# EAGLE schematic GucciMain (EAGLE 9.1.0)
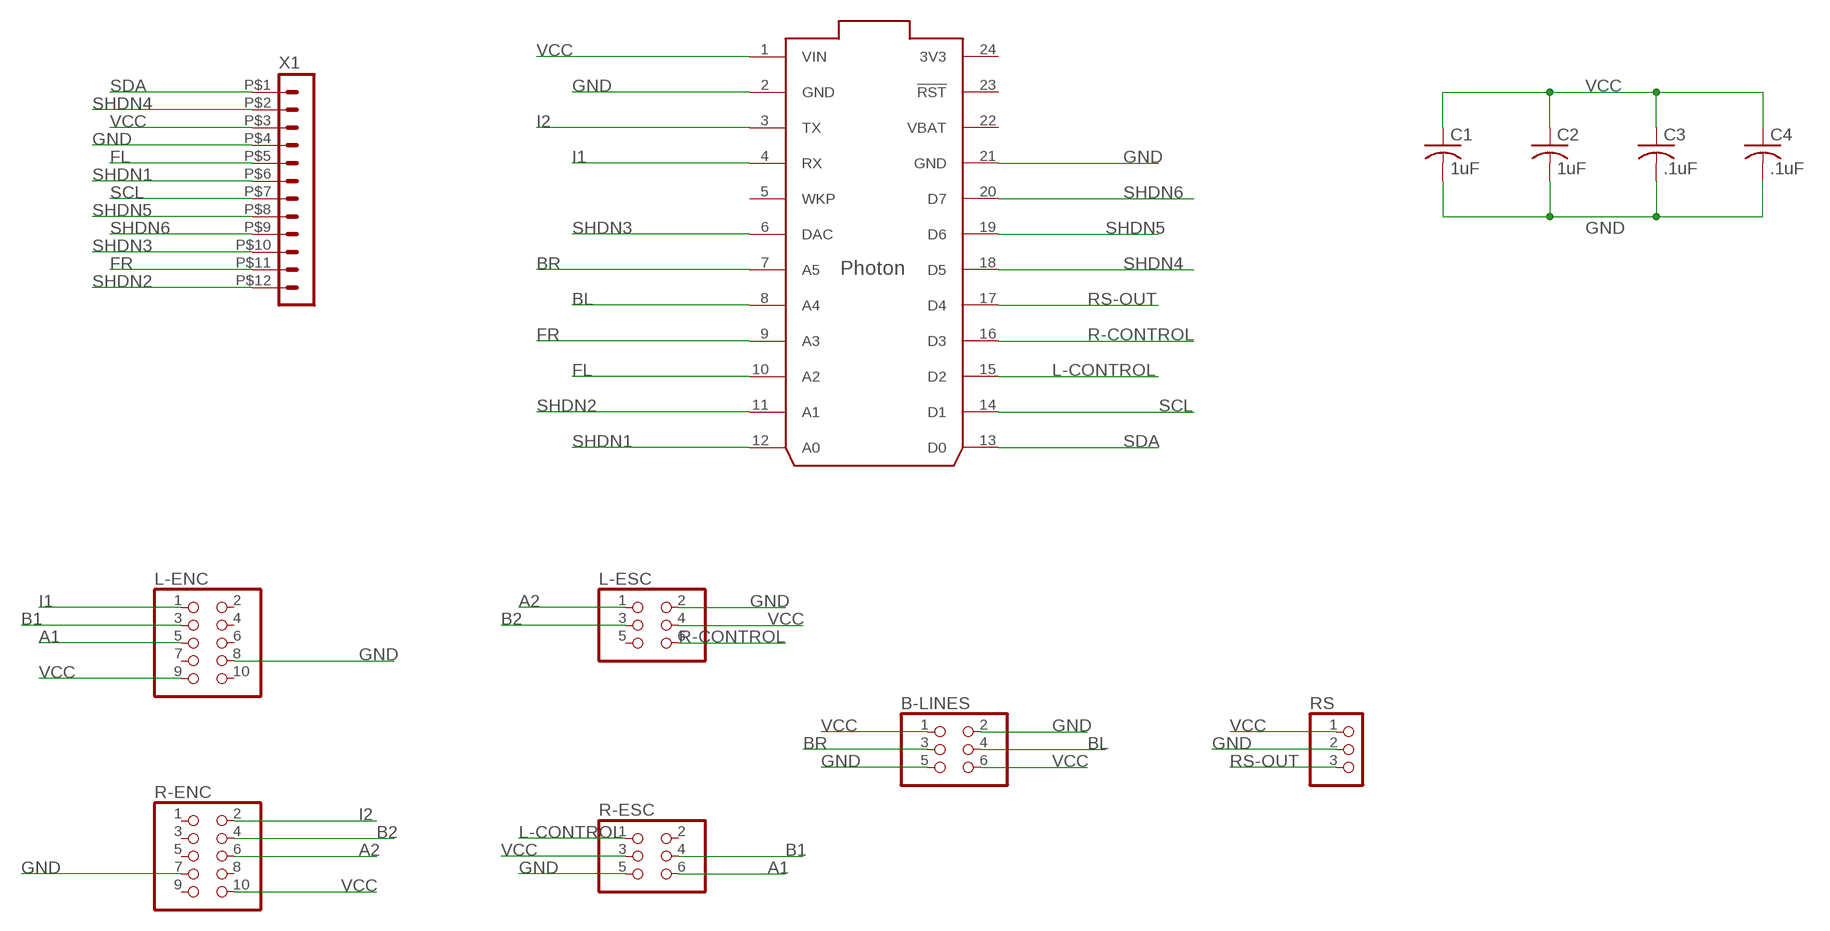
[diagram p0: schematic, sheet 1]

## Parts
B-LINES  PINHD-2X3/90  [2X03/90]
C1  1uF  C-USC0402  [C0402]
C2  1uF  C-USC0402  [C0402]
C3  .1uF  C-USC0402  [C0402]
C4  .1uF  C-USC0402  [C0402]
L-ENC  PINHD-2X5/90  [2X05/90]
L-ESC  PINHD-2X3  [2X03]
PHOTON  PHOTON  PHOTON_WITH_HEADERS  [PHOTON]
R-ENC  PINHD-2X5/90  [2X05/90]
R-ESC  PINHD-2X3  [2X03]
RS  PINHD-1X3  [1X03]
X1  HEADER_POS12_43045-1212  [43045-1212]

## Nets
A1: L-ENC.5 R-ESC.6
A2: L-ESC.1 R-ENC.6
B1: L-ENC.3 R-ESC.4
B2: L-ESC.3 R-ENC.4
BL: B-LINES.4 PHOTON.8(A4)
BR: B-LINES.3 PHOTON.7(A5)
FL: PHOTON.10(A2) X1.P$5
FR: PHOTON.9(A3) X1.P$11
GND: B-LINES.2 B-LINES.5 C1.2 C2.2 C3.2 C4.2 L-ENC.8 L-ESC.2 PHOTON.2(GND) PHOTON.21(GND) R-ENC.7 R-ESC.5 RS.2 X1.P$4
I1: L-ENC.1 PHOTON.4(RX)
I2: PHOTON.3(TX) R-ENC.2
L-CONTROL: PHOTON.15(D2) R-ESC.1
R-CONTROL: L-ESC.6 PHOTON.16(D3)
RS-OUT: PHOTON.17(D4) RS.3
SCL: PHOTON.14(D1) X1.P$7
SDA: PHOTON.13(D0) X1.P$1
SHDN1: PHOTON.12(A0) X1.P$6
SHDN2: PHOTON.11(A1) X1.P$12
SHDN3: PHOTON.6(DAC) X1.P$10
SHDN4: PHOTON.18(D5) X1.P$2
SHDN5: PHOTON.19(D6) X1.P$8
SHDN6: PHOTON.20(D7) X1.P$9
VCC: B-LINES.1 B-LINES.6 C1.1 C2.1 C3.1 C4.1 L-ENC.9 L-ESC.4 PHOTON.1(VIN) R-ENC.10 R-ESC.3 RS.1 X1.P$3
Unconnected: L-ENC.2 L-ENC.4 L-ENC.6 L-ENC.7 L-ENC.10 L-ESC.5 PHOTON.5(WKP) PHOTON.23(!RST) R-ENC.1 R-ENC.3 R-ENC.5 R-ENC.8 R-ENC.9 R-ESC.2

## Power pins joined to a net without a drawn wire
3V3: PHOTON.24(3V3)
VBAT: PHOTON.22(VBAT)

## Library data of the parts
B-LINES L-ESC R-ESC = pinhead:PINHD-2X3: PIN HEADER
C1-C4 = rcl:C-US: CAPACITOR, American symbol; SPICEPREFIX: C
L-ENC R-ENC = pinhead:PINHD-2X5: PIN HEADER
PHOTON = Particle:PHOTON
RS = pinhead:PINHD-1X3: PIN HEADER
X1 = con-molex-micro-fit-3_0:HEADER_POS12_?: Molex - Micro-Fit 3.0 Series connector, 3.00mm (0.118") pitch header, 12 positions.